# EAGLE schematic wheelin-rtm (EAGLE 7.6.0)
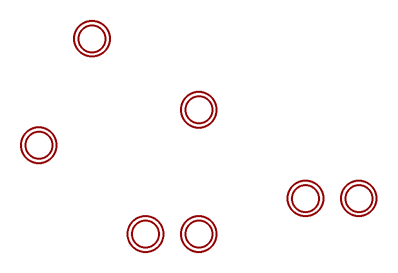
[diagram p0: schematic, sheet 1]

## Parts
U$1  MOUNTINGHOLE2.0  [MOUNTINGHOLE_2.0_PLATED]
U$2  MOUNTINGHOLE2.0  [MOUNTINGHOLE_2.0_PLATED]
U$3  MOUNTINGHOLE2.0  [MOUNTINGHOLE_2.0_PLATED]
U$4  MOUNTINGHOLE2.0  [MOUNTINGHOLE_2.0_PLATED]
U$7  MOUNTINGHOLE2.0  [MOUNTINGHOLE_2.0_PLATED]
U$8  MOUNTINGHOLE2.0  [MOUNTINGHOLE_2.0_PLATED]
U$15  MOUNTINGHOLE  [MOUNTINGHOLE_3.0_PLATED_VIAS]

## Library data of the parts
U$1-U$4 U$7 U$8 U$15 = microbuilder:MOUNTINGHOLE: Mounting Hole For #2 screws (0.086"/2.18mm width, 0.094"/2.4mm hole) use 2.5mm; BOM: EXCLUDE

## Net classes
0 default: width 0.381 mm, drill 0.381 mm, clearance 0.305 mm
1 GND: width 0.508 mm, drill 0.381 mm, clearance 0.305 mm
2 pwr: width 0.508 mm, drill 0.381 mm, clearance 0.305 mm